# EAGLE design PDMschemC-Car2018 (EAGLE 8.4.3)
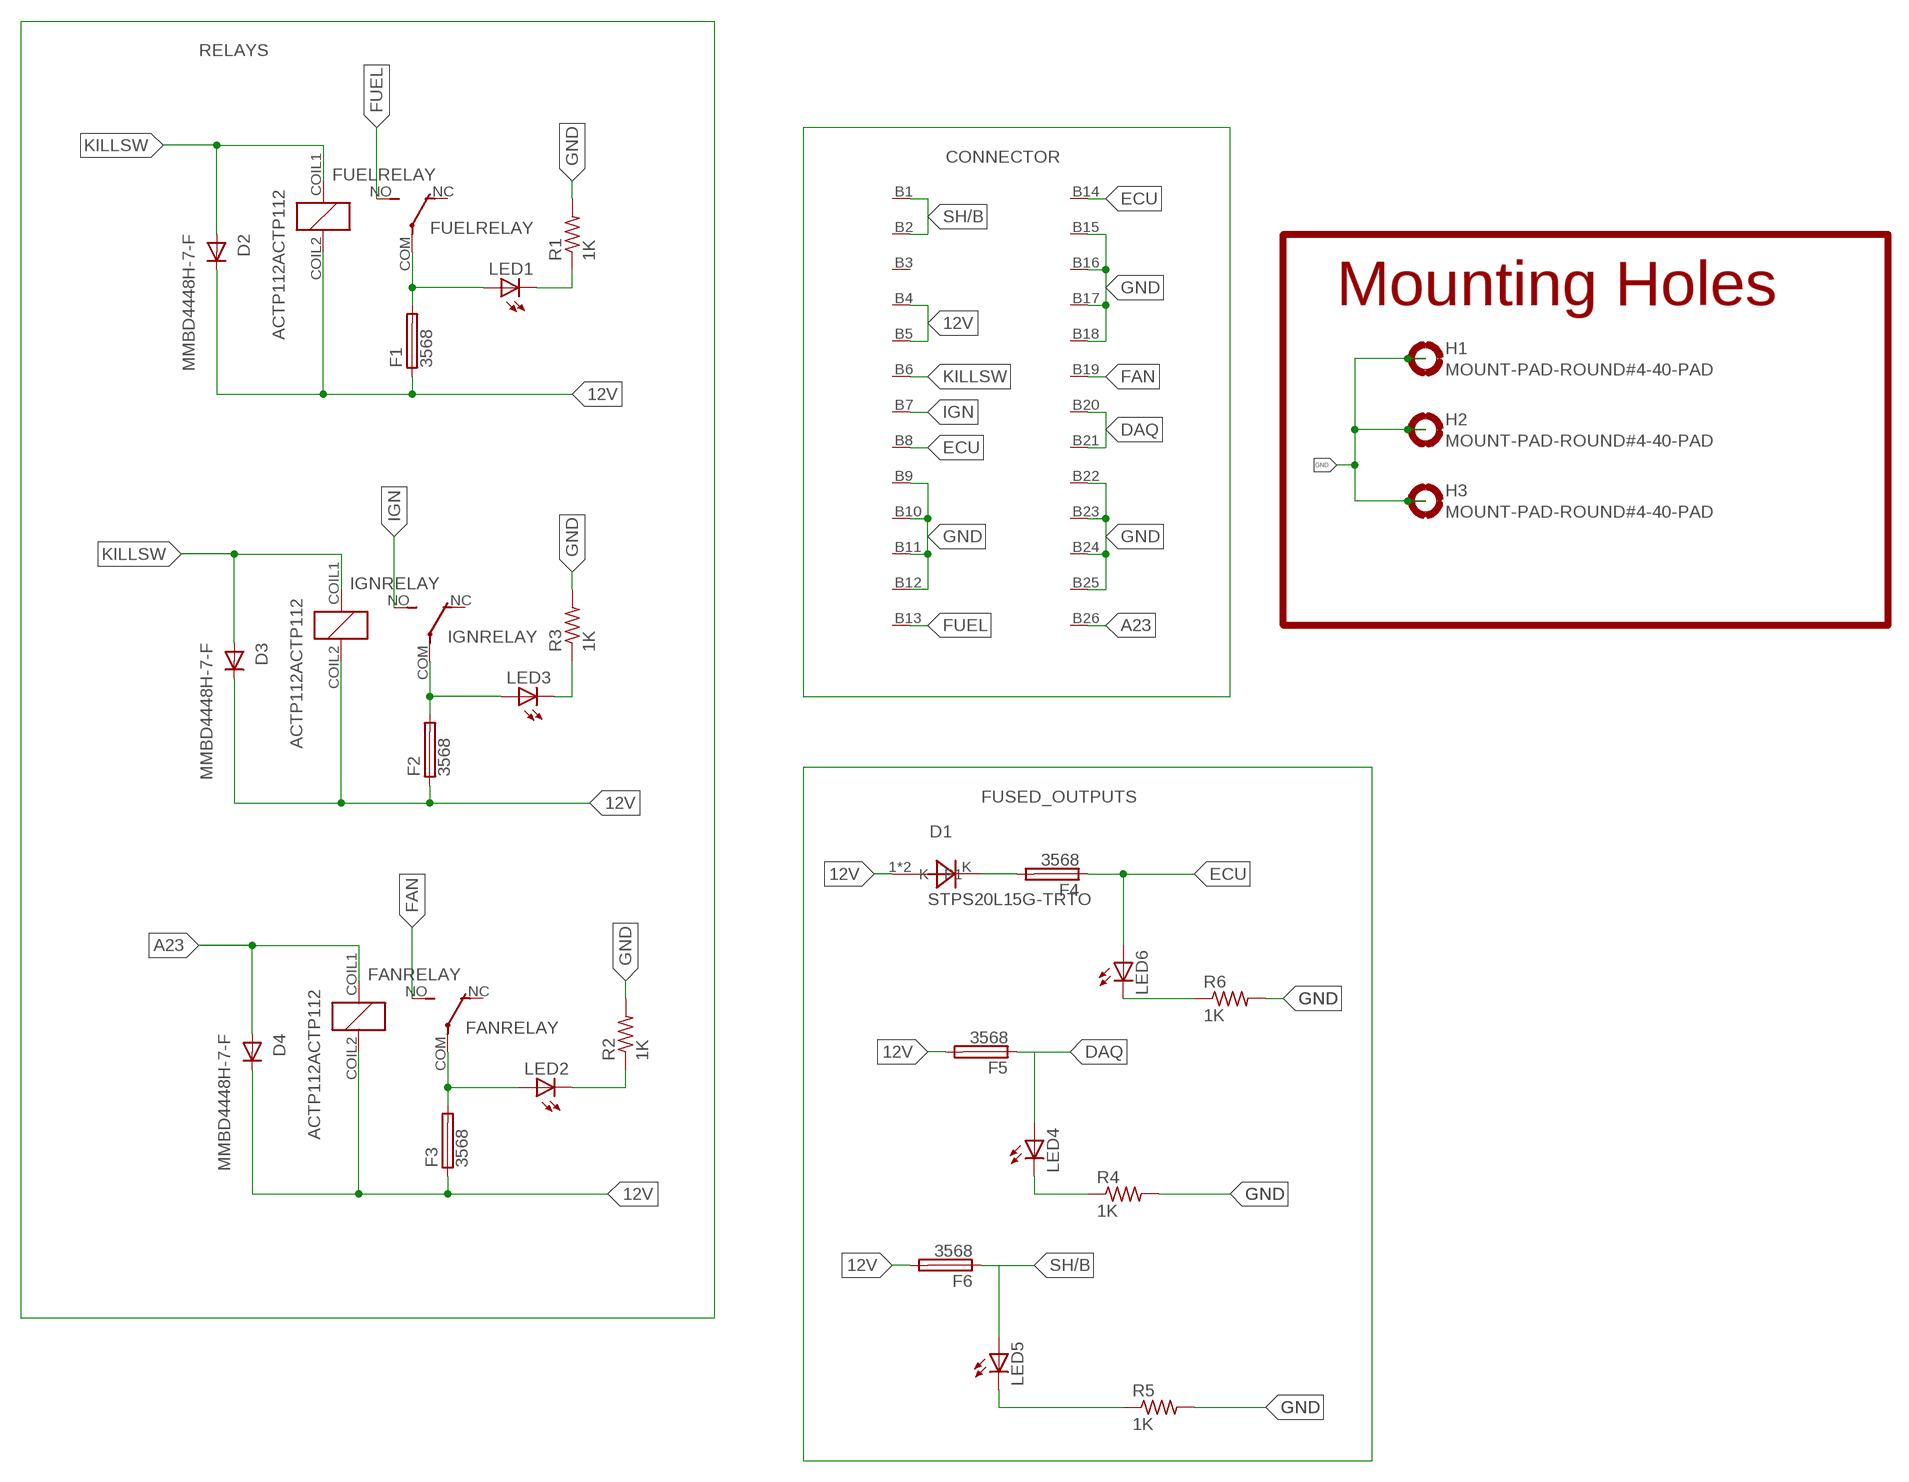
[diagram p0: schematic, sheet 1]

## Parts
D1  STPS20L15G-TRTO  [TO-262DIODE]
D2  MMBD4448H-7-F  [SOT23-3]
D3  MMBD4448H-7-F  [SOT23-3]
D4  MMBD4448H-7-F  [SOT23-3]
F1  3568  [3568]
F2  3568  [3568]
F3  3568  [3568]
F4  3568  [3568]
F5  3568  [3568]
F6  3568  [3568]
FANRELAY  ACTP112ACTP112  [ACTP112]
FUELRELAY  ACTP112ACTP112  [ACTP112]
H1  MOUNT-PAD-ROUND#4-40-PAD  [#4-40-PAD-ROUND]
H2  MOUNT-PAD-ROUND#4-40-PAD  [#4-40-PAD-ROUND]
H3  MOUNT-PAD-ROUND#4-40-PAD  [#4-40-PAD-ROUND]
IGNRELAY  ACTP112ACTP112  [ACTP112]
LED1  LEDCHIPLED_0805  [CHIPLED_0805]
LED2  LEDCHIPLED_0805  [CHIPLED_0805]
LED3  LEDCHIPLED_0805  [CHIPLED_0805]
LED4  LEDCHIPLED_0805  [CHIPLED_0805]
LED5  LEDCHIPLED_0805  [CHIPLED_0805]
LED6  LEDCHIPLED_0805  [CHIPLED_0805]
R1  1K  R-US_R0805  [R0805]
R2  1K  R-US_R0805  [R0805]
R3  1K  R-US_R0805  [R0805]
R4  1K  R-US_R0805  [R0805]
R5  1K  R-US_R0805  [R0805]
R6  1K  R-US_R0805  [R0805]
U$1  SUPERSEAL1.0_26POS  [SUPERSEAL1.0_26POS]

## Nets
12V: D1.1 D1.2(P1) D2.3(C) D3.3(C) D4.3(C) F1.1 F1.2 F2.1 F2.2 F3.1 F3.2 F5.3 F5.4 F6.3 F6.4 FANRELAY.COIL2 FUELRELAY.COIL2 IGNRELAY.COIL2 U$1.B4 U$1.B5
A23: D4.1(A) FANRELAY.COIL1 U$1.B26
DAQ: F5.1 F5.2 LED4.A U$1.B20 U$1.B21
ECU: F4.1 F4.2 LED6.A U$1.B8 U$1.B14
FAN: FANRELAY.NO U$1.B19
FUEL: FUELRELAY.NO U$1.B13
GND: H1.P$1(MOUNT) H2.P$1(MOUNT) H3.P$1(MOUNT) R1.2 R2.2 R3.2 R4.2 R5.2 R6.2 U$1.B9 U$1.B10 U$1.B11 U$1.B12 U$1.B15 U$1.B16 U$1.B17 U$1.B18 U$1.B22 U$1.B23 U$1.B24 U$1.B25
IGN: IGNRELAY.NO U$1.B7
KILLSW: D2.1(A) D3.1(A) FUELRELAY.COIL1 IGNRELAY.COIL1 U$1.B6
N$1: F3.3 F3.4 FANRELAY.COM LED2.A
N$2: LED1.C R1.1
N$3: F1.3 F1.4 FUELRELAY.COM LED1.A
N$4: LED2.C R2.1
N$5: LED3.C R3.1
N$6: F2.3 F2.4 IGNRELAY.COM LED3.A
N$7: LED4.C R4.1
N$8: LED6.C R6.1
N$9: D1.K F4.3 F4.4
N$10: LED5.C R5.1
SH/B: F6.1 F6.2 LED5.A U$1.B1 U$1.B2
Unconnected: FANRELAY.NC FUELRELAY.NC IGNRELAY.NC U$1.B3

## Notes on the sheet
- Mounting Holes

## Library data of the parts
D1 = st-microelectronics:STPS20L15G-TR
D2-D4 = diodes-inc:MMBD4448H-7-F
F1-F6 = Keystone:3568: Mini ATC Fuse Holder 20A 500V 1 Circuit Blade PCB
FANRELAY FUELRELAY IGNRELAY = panasonic:ACTP112: ACTP112 Through-Hole Micro Relay
H1-H3 = holes:MOUNT-PAD-ROUND: MOUNTING PAD, round
LED1-LED6 = led:LED: LED OSRAM: - CHIPLED LG R971, LG N971, LY N971, LG Q971, LY Q971, LO R971, LY R971 LH N974, LH R974 LS Q976, LO Q976, LY Q976 LO Q996 - Hyper CHIPLED LW Q18S LB Q993, LB Q99A, LB R99A - SideLED LS A670, LO A670, LY A670, LG A670, LP A670 LB A673, LV A673, LT A673, LW A673 LH A674 LY A675 LS A676, LA A676, LO A676, LY A676, LW A676 LS A679, LY A679, LG A679 - Hyper Micro SIDELED® LS Y876, LA Y876, LO Y876, LY Y876 LT Y87S - SmartLED LW L88C, LW L88S LB L89C, LB L89S, LG L890 LS L89K, LO L89K, LY L89K LS L896, LA L896, LO L896, LY L896 - TOPLED LS T670, LO T670, LY T670, LG T670, LP T670 LSG T670, LSP T670, LSY T670, LOP T670, LYG T670 LG T671, LOG T671, LSG T671 LB T673, LV T673, LT T673, LW T673 LH T674 LS T676, LA T676, LO T676, LY T676, LB T676, LH T676, LSB T676, LW T676 LB T67C, LV T67C, LT T67C, LS T67K, LO T67K, LY T67K, LW E67C LS E67B, LA E67B, LO E67B, LY E67B, LB E67C, LV E67C, LT E67C LW T67C LS T679, LY T679, LG T679 LS T770, LO T770, LY T770, LG T770, LP T770 LB T773, LV T773, LT T773, LW T773 LH T774 LS E675, LA E675, LY E675, LS T675 LS T776, LA T776, LO T776, LY T776, LB T776 LHGB T686 LT T68C, LB T68C - Hyper Mini TOPLED® LB M676 - Mini TOPLED Santana® LG M470 LS M47K, LO M47K, LY M47K Source: http://www.osram.convergy.de LUXEON: - LUMILED® LXK2-PW12-R00, LXK2-PW12-S00, LXK2-PW14-U00, LXK2-PW14-V00 LXK2-PM12-R00, LXK2-PM12-S00, LXK2-PM14-U00 LXK2-PE12-Q00, LXK2-PE12-R00, LXK2-PE12-S00, LXK2-PE14-T00, LXK2-PE14-U00 LXK2-PB12-K00, LXK2-PB12-L00, LXK2-PB12-M00, LXK2-PB14-N00, LXK2-PB14-P00, LXK2-PB14-Q00 LXK2-PR12-L00, LXK2-PR12-M00, LXK2-PR14-Q00, LXK2-PR14-R00 LXK2-PD12-Q00, LXK2-PD12-R00, LXK2-PD12-S00 LXK2-PH12-R00, LXK2-PH12-S00 LXK2-PL12-P00, LXK2-PL12-Q00, LXK2-PL12-R00 Source: www.luxeon.com KINGBRIGHT: KA-3528ASYC Source: www.kingbright.com
R1-R6 = resistor:R-US_: RESISTOR, American symbol
U$1 = TE:SUPERSEAL1.0_26POS

## Board
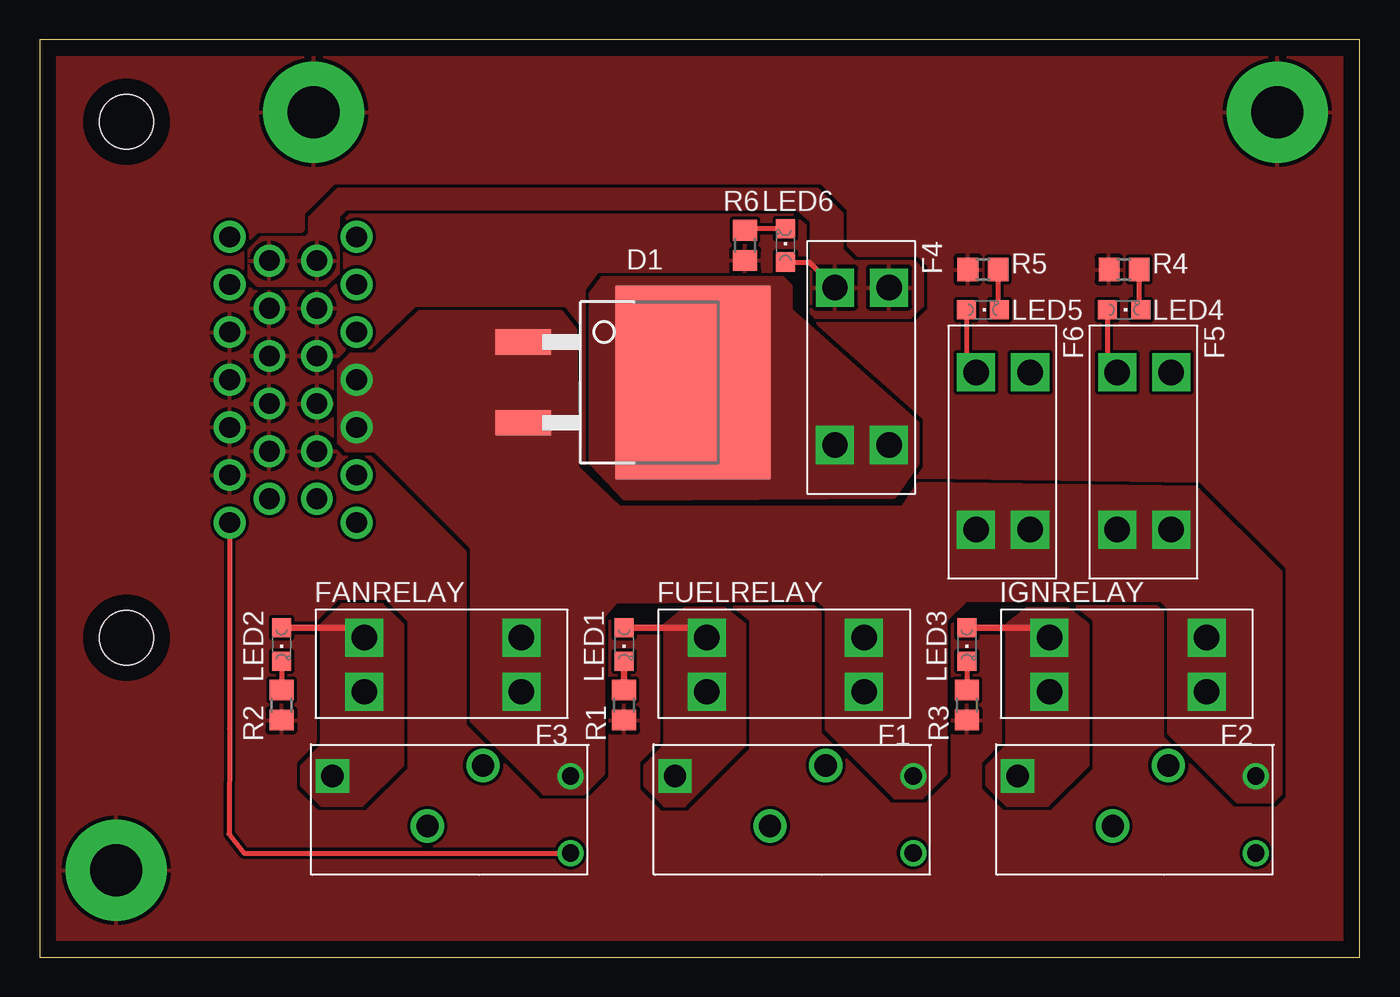
[diagram p1: board, top side]
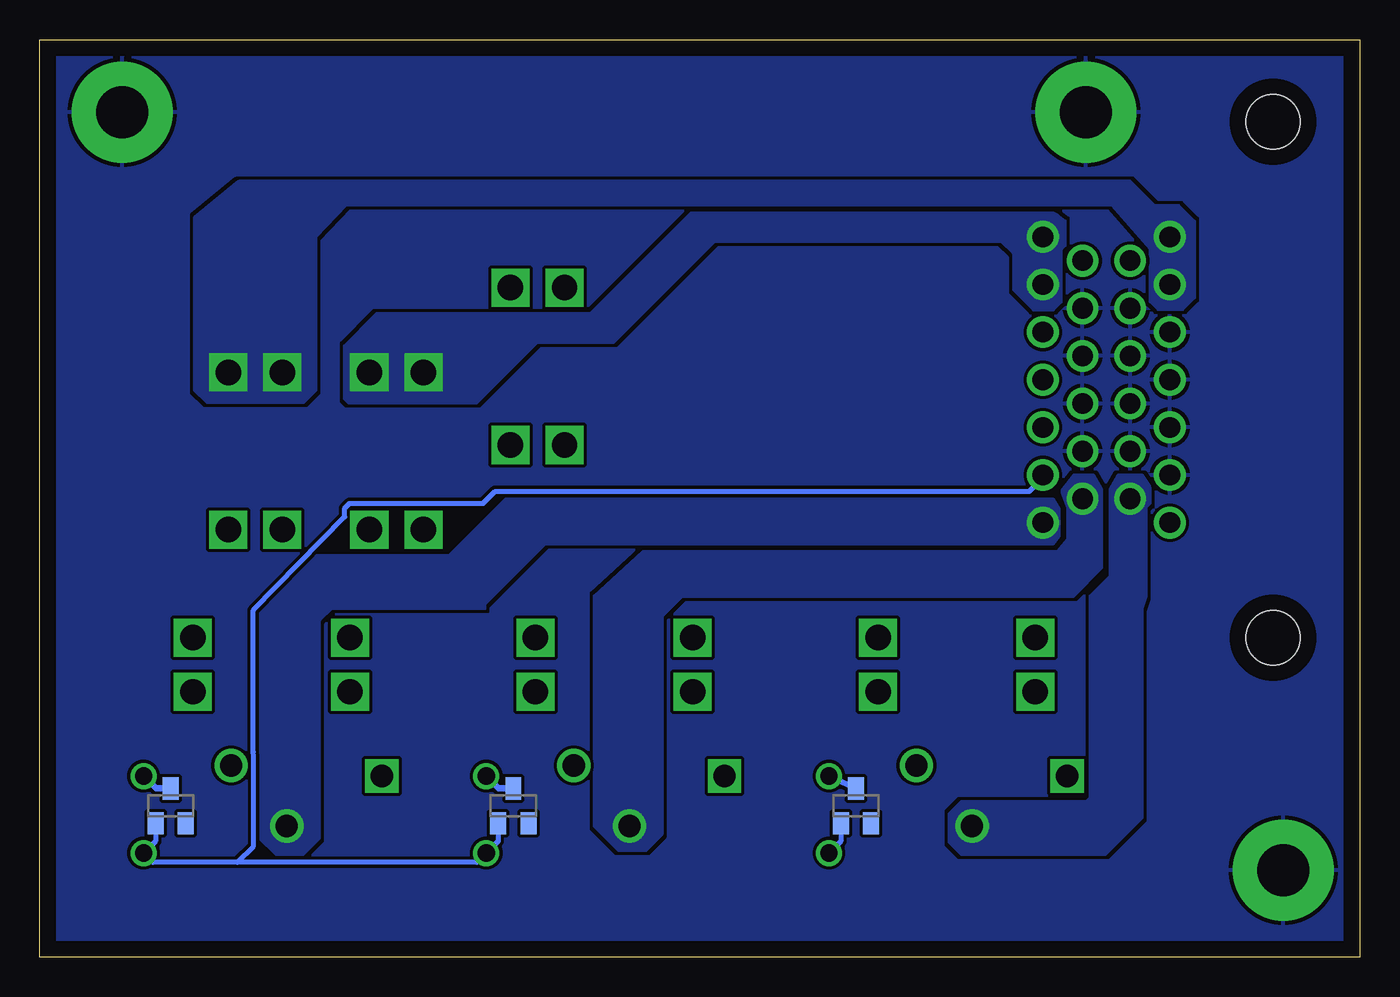
[diagram p2: board, bottom side, seen from below]

Size 83.19 x 57.78 mm. Coordinates in mm from the lower left corner, seen from the top.
Outline: 0,0 83.19,0 83.19,57.78 0,57.78 0,0
Copper layers (1*16): Top 0.035mm / dielectric 1.5mm / Bottom 0.035mm
Design rules "default *": minimum track width 8mil, minimum drill 15mil, track to track 8mil, track to pad 8mil, pad to pad 8mil, via to via 8mil, smd to smd 8mil, copper to edge 40mil, drill to drill 8mil, minimum pad ring 10mil, minimum via ring 8mil, stop-mask expansion 4mil, vias tented up to drill 0mil, thermal gap 10mil

### Footprints (pad centres in the part's own frame; a part is rotated, then mirrored left to right if it is on the bottom)
TO-262DIODE = smd 1.6 x 3.5: 1 -2.54,-5.08; 2 2.54,-5.08 | smd 12.2 x 9.75: K 0,5.601
SOT23-3 = smd 1 x 1.4: 1 -0.95,-1.1; 2 0.95,-1.1; 3 0,1.1
3568 = drill 1.6 square: 1 -4.953,1.702; 2 -4.953,-1.702; 3 4.953,1.702; 4 4.953,-1.702
ACTP112 = drill 1.092: COIL1 5.512,-5.512; COIL2 5.512,-0.66 | drill 1.397 square: COM -9.5,-0.66 | drill 1.397: NC 0,0; NO -3.505,-3.81
#4-40-PAD-ROUND = drill 3.264 pad 6.35: P$1 0,0
CHIPLED_0805 = smd 1.2 x 1.2: A 0,-1.05; C 0,1.05
R0805 = smd 1.3 x 1.5: 1 -0.95,0; 2 0.95,0
SUPERSEAL1.0_26POS = drill 1.3 pad 2: B1 -9.17,4.73; B2 -6.17,4.73; B3 -3.17,4.73; B4 -0.17,4.73; B5 2.83,4.73; B6 5.83,4.73; B7 8.83,4.73; B8 -7.67,2.23; B9 -4.67,2.23; B10 -1.67,2.23; B11 1.33,2.23; B12 4.33,2.23; B13 7.33,2.23; B14 -7.67,-0.77; B15 -4.67,-0.77; B16 -1.67,-0.77; B17 1.33,-0.77; B18 4.33,-0.77; B19 7.33,-0.77; B20 -9.17,-3.27; B21 -6.17,-3.27; B22 -3.17,-3.27; B23 -0.17,-3.27; B24 2.83,-3.27; B25 5.83,-3.27; B26 8.83,-3.27 | hole 3.4: -16.42,-9.77; 16.08,-9.77

### Placement (x,y rotation side)
D1  35.56,36.2 270 top
D2  74.93,9.53 0 bottom
D3  53.34,9.53 0 bottom
D4  31.75,9.53 0 bottom
F1  46.99,18.42 180 top
F2  68.58,18.42 180 top
F3  25.4,18.42 180 top
F4  51.82,37.21 270 top
F5  69.6,31.88 270 top
F6  60.71,31.88 270 top
FANRELAY  27.94,12.06 0 top
FUELRELAY  49.53,12.06 0 top
H1  4.83,5.46 0 top
H2  17.27,53.21 0 top
H3  77.98,53.21 0 top
IGNRELAY  71.12,12.06 0 top
LED1  36.83,19.69 180 top
LED2  15.24,19.69 180 top
LED3  58.42,19.69 180 top
LED4  68.33,40.77 270 top
LED5  59.44,40.77 270 top
LED6  46.99,44.83 0 top
R1  36.83,15.88 270 top
R2  15.24,15.88 270 top
R3  58.42,15.88 270 top
R4  68.33,43.31 180 top
R5  59.44,43.31 180 top
R6  44.45,44.83 270 top
U$1  15.24,36.2 270 top

### Tracks (layer width: path | path; a pad name or v marks a point on that pad's centre or on a via)
12V
  Bottom 0.406: FANRELAY.COIL2 D4.3 | D3.3 54.26,10.62 FUELRELAY.COIL2 | D2.3 75.85,10.62 IGNRELAY.COIL2
  pour Top (no thermals): 18.8,37.21 18.8,32.38 19.3,31.88 21.08,31.88 27.18,25.78 27.18,14.86 31.75,10.29 34.29,10.29 35.56,11.56 35.56,21.46 36.32,22.35 49.02,22.48 49.53,21.97 49.53,14.35 53.85,10.03 55.63,10.03 57.15,11.56 57.15,21.21 58.42,22.48 70.61,22.48 71.12,21.97 71.12,14.1 75.44,9.78 77.72,9.78 78.23,10.29 78.23,24.26 72.9,29.59 55.37,29.85 54.36,28.32 36.58,28.32 33.91,30.86 33.78,39.5 32.89,40.64 23.88,40.64 21.08,37.97 19.56,37.97
A23
  Top 0.305: U$1.B26 11.97,14.38 11.94,7.75 12.88,6.55 FANRELAY.COIL1
  Bottom 0.305: D4.1 32.7,7.3 FANRELAY.COIL1
DAQ
  Top 0.305: LED4.A 67.28,37.45 F5.2
  pour Bottom (no thermals): 13.21,41.27 13.21,44.58 15.62,47.37 63.88,47.37 65.79,45.34 65.79,35.69 66.55,34.92 72.64,34.92 73.41,35.69 73.41,46.61 70.61,48.89 14.48,48.89 12.95,47.37 11.43,47.37 10.41,46.35 10.41,41.53 11.18,40.77 12.7,40.77
ECU
  Top 0.305: LED6.A 48.5,43.78 F4.2
  pour Top: 48.64,40.51 48.64,46.35 47.75,47.12 19.3,47.12 18.8,46.61 18.8,43.05 18.03,42.29 13.72,42.29 13.21,42.8 13.21,44.58 13.97,45.34 16.76,45.34 17.02,45.59 17.02,46.61 18.8,48.39 49.02,48.39 50.55,46.86 50.55,44.58 51.31,43.81 55.12,43.81 55.63,43.31 55.63,41.02 54.86,40.26 48.9,40.26
FAN
  pour Bottom (no thermals): 15.75,29.46 15.75,24 17.02,22.73 17.02,10.03 17.27,9.78 25.15,9.78 25.91,9.02 25.91,7.24 25.15,6.48 16,6.48 13.72,8.76 13.72,21.97 13.46,22.73 13.46,28.32 13.21,28.58 13.21,29.59 13.72,30.35 15.24,30.35
FUEL
  pour Bottom (no thermals): 16.76,30.35 18.03,30.35 18.8,29.34 18.41,28.32 18.41,26.29 19.05,25.53 45.21,25.53 48.26,22.73 48.26,8.26 46.74,6.73 44.96,6.73 43.94,7.75 43.94,21.46 42.67,22.73 18.03,22.73 16.26,24.51 16.26,29.46
GND
  pour Bottom (rank 6): -2.29,65.15 -2.54,-2.67 -2.03,-2.92 84.33,-2.92 85.6,-1.65 85.6,66.17 84.84,66.93 -0.51,66.93
  pour Top (rank 6): -1.02,64.14 -1.27,-0.38 -0.76,-0.89 83.82,-0.89 83.82,65.41 -0.25,65.41 -0.76,64.9 -0.76,64.39
IGN
  pour Bottom (no thermals): 18.92,26.54 18.92,28.19 19.3,28.83 53.85,28.83 57.4,25.27 65.79,25.27 69.34,21.72 69.34,7.49 68.33,6.48 66.55,6.48 65.53,7.49 65.53,21.21 64.77,21.97 55.12,21.97 55.12,22.23 51.31,26.04 19.3,26.04
KILLSW
  Bottom 0.305: D3.1 54.29,7.3 FUELRELAY.COIL1 55.63,5.97 70.74,5.97 | 70.74,5.97 76.05,5.97 IGNRELAY.COIL1 75.88,7.3 D2.1 | 70.74,5.97 69.72,6.99 69.72,12.65 69.72,12.91 69.72,21.84 63.96,27.73 63.96,28.27 63.66,28.58 55.24,28.58 54.48,29.34 20.83,29.34 19.97,30.2 U$1.B6
N$1
  Top 0.406: LED2.A 19.83,20.74 F3.4
  pour Top (no thermals): 19.05,22.23 21.59,22.23 22.86,20.96 22.86,14.61 22.86,12.06 20.32,9.53 17.78,9.53 16.51,10.79 16.51,12.06 17.78,13.33 17.78,20.96
N$2
  Top 0.406: LED1.C R1.1
N$3
  Top 0.406: LED1.A 41.42,20.74 F1.4
  pour Top (no thermals): 39.37,20.96 39.37,13.33 38.1,12.06 38.1,10.79 39.37,9.53 40.64,9.53 44.45,13.33 44.45,20.96 43.18,21.97 40.64,21.97
N$4
  Top 0.305: LED2.C R2.1
N$5
  Top 0.305: LED3.C R3.1
N$6
  Top 0.406: LED3.A 63.01,20.74 F2.4
  pour Top (no thermals): 62.23,21.97 64.77,21.97 66.04,20.96 66.04,12.06 63.5,9.53 60.96,9.53 59.69,10.79 59.69,12.06 60.96,13.33 60.96,20.96
N$7
  Top 0.305: R4.1 69.28,40.87 LED4.C
N$8
  Top 0.305: LED6.C 44.55,45.88 R6.1
N$9
  pour Top (no thermals): 34.67,41.78 34.67,31.12 36.83,28.83 53.85,28.96 55.37,31.12 55.37,33.66 47.37,40.77 47.37,42.29 46.86,42.8 35.43,42.8
N$10
  Top 0.305: R5.1 60.39,40.87 LED5.C
SH/B
  Top 0.305: LED5.A 58.39,37.45 F6.2
  pour Bottom (no thermals): 19.3,46.86 42.16,46.86 48.51,40.51 61.98,40.51 64.01,38.48 64.01,35.18 63.75,34.92 55.63,34.92 51.82,38.73 46.99,38.73 40.64,45.09 22.61,45.09 21.84,44.32 21.84,42.04 20.57,40.77 19.3,40.77 18.8,41.27 18.8,44.58 18.54,44.83 18.54,46.35 19.05,46.74

### Text on the board
201bmp: C-PDM 2018 Designed by: Brad Petch / Dan Gutmann / Angel Delgado